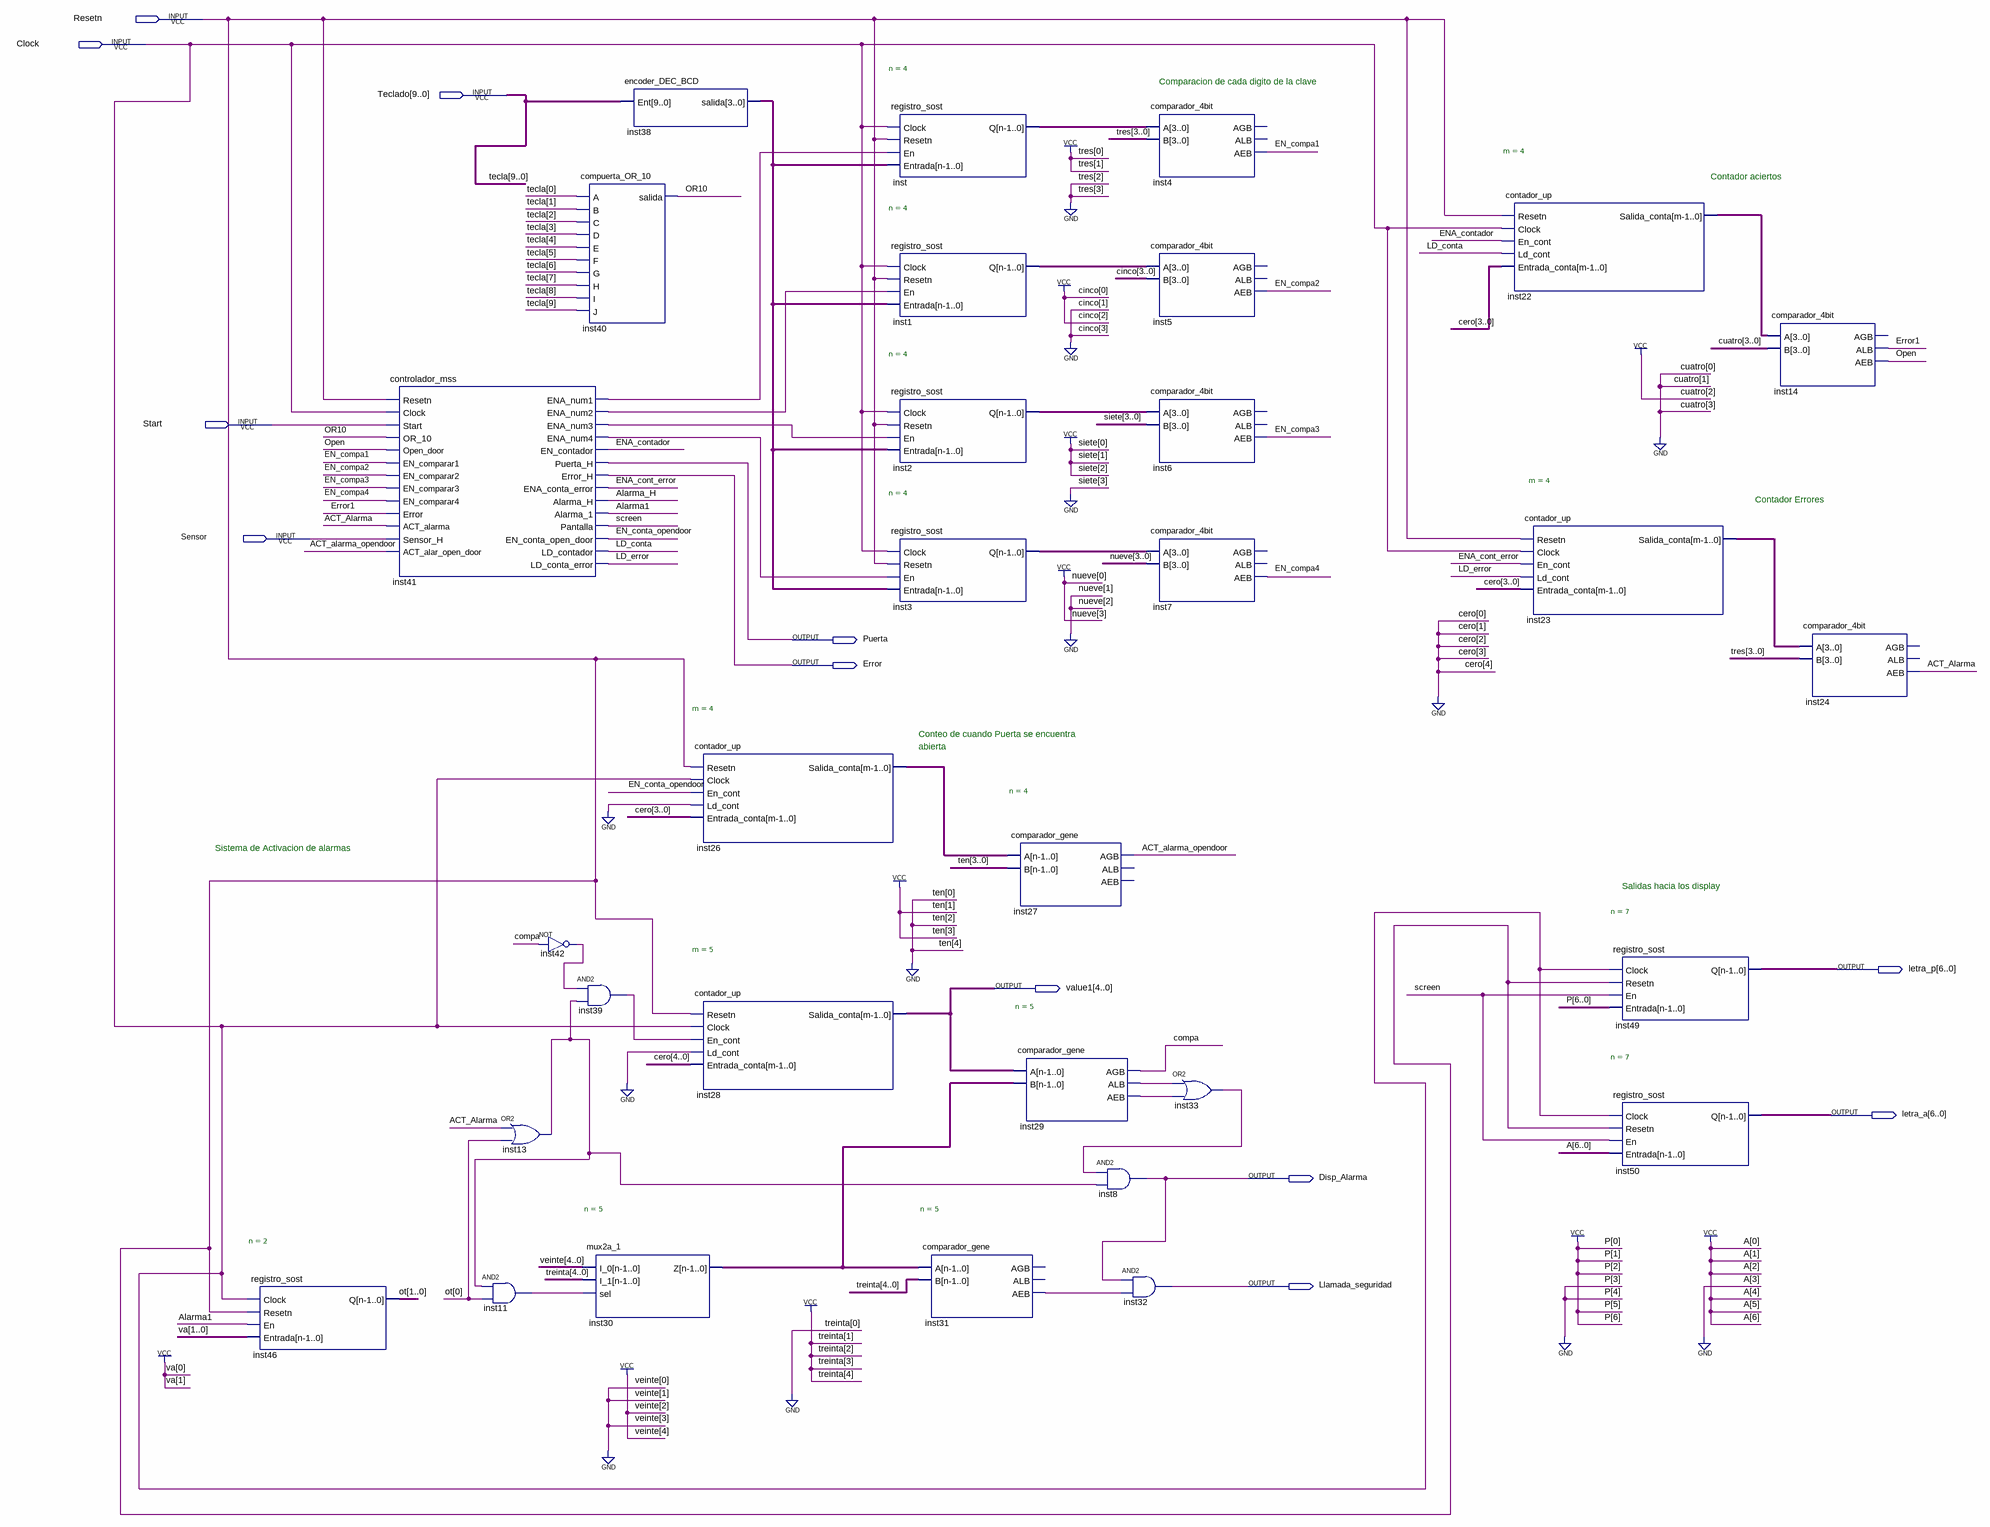
[diagram p0: schematic sheet]
// Quartus schematic diagrama_esquematic.bdf as structural Verilog: 31 symbols, 12 pins
module diagrama_esquematic (
  input  Resetn,
  input  Clock,
  input  [9:0] Teclado,
  input  Start,
  input  Sensor,
  output Puerta,
  output Error,
  output [6:0] letra_p,
  output [4:0] value1,
  output [6:0] letra_a,
  output Disp_Alarma,
  output Llamada_seguridad
);

  wire ACT_Alarma, ACT_alarma_opendoor, Alarma1, Alarma_H, compa, EN_compa1, EN_compa2, EN_compa3, EN_compa4,
       EN_conta_opendoor, ENA_cont_error, ENA_contador, Error1, inst11_out, inst13_out, inst29_aeb,
       inst29_alb, inst31_aeb, inst33_out, inst39_out, inst41_ena_num1, inst41_ena_num2, inst41_ena_num3,
       inst41_ena_num4, inst42_out, LD_conta, LD_error, Open, OR10, screen;
  wire [1:0] ot;
  wire [3:0] inst1_q, inst2_q, inst3_q, inst22_salida_conta, inst23_salida_conta, inst26_salida_conta,
       inst38_salida, inst_q;
  wire [4:0] inst30_z;

  registro_sost #(.n(2)) inst46 (.Clock(Clock), .Resetn(Resetn), .En(Alarma1), .Entrada(2'b11), .Q(ot));
  controlador_mss inst41 (
    .Resetn(Resetn), .Clock(Clock), .Start(Start), .OR_10(OR10), .Open_door(Open), .EN_comparar1(EN_compa1),
    .EN_comparar2(EN_compa2), .EN_comparar3(EN_compa3), .EN_comparar4(EN_compa4), .Error(Error1),
    .ACT_alarma(ACT_Alarma), .Sensor_H(Sensor), .ACT_alar_open_door(ACT_alarma_opendoor),
    .ENA_num1(inst41_ena_num1), .ENA_num2(inst41_ena_num2), .ENA_num3(inst41_ena_num3),
    .ENA_num4(inst41_ena_num4), .EN_contador(ENA_contador), .Puerta_H(Puerta), .Error_H(Error),
    .ENA_conta_error(ENA_cont_error), .Alarma_H(Alarma_H), .Alarma_1(Alarma1), .Pantalla(screen),
    .EN_conta_open_door(EN_conta_opendoor), .LD_contador(LD_conta), .LD_conta_error(LD_error));
  or inst13 (inst13_out, ACT_Alarma, ot[0]);
  and inst11 (inst11_out, inst13_out, ot[0]);
  compuerta_OR_10 inst40 (
    .A(Teclado[0]), .B(Teclado[1]), .C(Teclado[2]), .D(Teclado[3]), .E(Teclado[4]), .F(Teclado[5]),
    .G(Teclado[6]), .H(Teclado[7]), .I(Teclado[8]), .J(Teclado[9]), .salida(OR10));
  not inst42 (inst42_out, compa);
  and inst39 (inst39_out, inst42_out, inst13_out);
  encoder_DEC_BCD inst38 (.Ent(Teclado), .salida(inst38_salida));
  mux2a_1 #(.n(5)) inst30 (.I_0(5'b10100), .I_1(5'b11110), .sel(inst11_out), .Z(inst30_z));
  contador_up #(.m(4)) inst26 (
    .Resetn(Resetn), .Clock(Clock), .En_cont(EN_conta_opendoor), .Ld_cont(1'b0), .Entrada_conta(4'b0000),
    .Salida_conta(inst26_salida_conta));
  contador_up #(.m(5)) inst28 (
    .Resetn(Resetn), .Clock(Clock), .En_cont(inst39_out), .Ld_cont(1'b0), .Entrada_conta({5{1'b0}}),
    .Salida_conta(value1));
  registro_sost #(.n(4)) inst (
    .Clock(Clock), .Resetn(Resetn), .En(inst41_ena_num1), .Entrada(inst38_salida), .Q(inst_q));
  registro_sost #(.n(4)) inst1 (
    .Clock(Clock), .Resetn(Resetn), .En(inst41_ena_num2), .Entrada(inst38_salida), .Q(inst1_q));
  registro_sost #(.n(4)) inst2 (
    .Clock(Clock), .Resetn(Resetn), .En(inst41_ena_num3), .Entrada(inst38_salida), .Q(inst2_q));
  registro_sost #(.n(4)) inst3 (
    .Clock(Clock), .Resetn(Resetn), .En(inst41_ena_num4), .Entrada(inst38_salida), .Q(inst3_q));
  comparador_gene #(.n(5)) inst31 (.A(inst30_z), .B(5'b11110), .AEB(inst31_aeb));  // open: AGB, ALB
  comparador_gene #(.n(4)) inst27 (.A(inst26_salida_conta), .B(4'b1010), .AGB(ACT_alarma_opendoor));  // open: ALB, AEB
  comparador_gene #(.n(5)) inst29 (.A(value1), .B(inst30_z), .AGB(compa), .ALB(inst29_alb), .AEB(inst29_aeb));
  and inst8 (Disp_Alarma, inst33_out, inst13_out);
  and inst32 (Llamada_seguridad, Disp_Alarma, inst31_aeb);
  comparador_4bit inst4 (.A(inst_q), .B(4'b0011), .AEB(EN_compa1));  // open: AGB, ALB
  comparador_4bit inst5 (.A(inst1_q), .B(4'b0101), .AEB(EN_compa2));  // open: AGB, ALB
  comparador_4bit inst6 (.A(inst2_q), .B(4'b0111), .AEB(EN_compa3));  // open: AGB, ALB
  comparador_4bit inst7 (.A(inst3_q), .B(4'b1001), .AEB(EN_compa4));  // open: AGB, ALB
  or inst33 (inst33_out, inst29_alb, inst29_aeb);
  contador_up #(.m(4)) inst22 (
    .Resetn(Resetn), .Clock(Clock), .En_cont(ENA_contador), .Ld_cont(LD_conta), .Entrada_conta(4'b0000),
    .Salida_conta(inst22_salida_conta));
  contador_up #(.m(4)) inst23 (
    .Resetn(Resetn), .Clock(Clock), .En_cont(ENA_cont_error), .Ld_cont(LD_error), .Entrada_conta(4'b0000),
    .Salida_conta(inst23_salida_conta));
  registro_sost #(.n(7)) inst49 (.Clock(Clock), .Resetn(Resetn), .En(screen), .Entrada(7'b1100111), .Q(letra_p));
  registro_sost #(.n(7)) inst50 (.Clock(Clock), .Resetn(Resetn), .En(screen), .Entrada(7'b1110111), .Q(letra_a));
  comparador_4bit inst14 (.A(inst22_salida_conta), .B(4'b0100), .ALB(Error1), .AEB(Open));  // open: AGB
  comparador_4bit inst24 (.A(inst23_salida_conta), .B(4'b0011), .AEB(ACT_Alarma));  // open: AGB, ALB

  // Other names for the same wires on the sheet: tecla[9:0] = Teclado

  // Notes on the sheet:
  //   Comparacion de cada digito de la clave 
  //   Contador aciertos
  //   Contador Errores
  //   Conteo de cuando Puerta se encuentra 
  //   abierta
  //   Sistema de Activacion de alarmas
  //   Salidas hacia los display
endmodule
